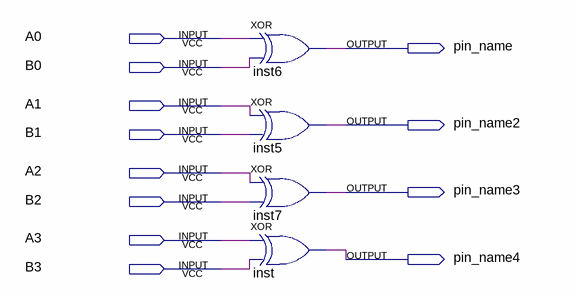
[diagram p0: schematic sheet]
// Quartus schematic Block1.bdf as structural Verilog: 4 symbols, 12 pins
module Block1 (
  input  A0,
  input  B0,
  input  A1,
  input  B1,
  input  A2,
  input  B2,
  input  A3,
  input  B3,
  output pin_name,
  output pin_name2,
  output pin_name3,
  output pin_name4
);

  xor inst6 (pin_name, A0, B0);
  xor inst5 (pin_name2, A1, B1);
  xor inst7 (pin_name3, A2, B2);
  xor inst (pin_name4, A3, B3);
endmodule
